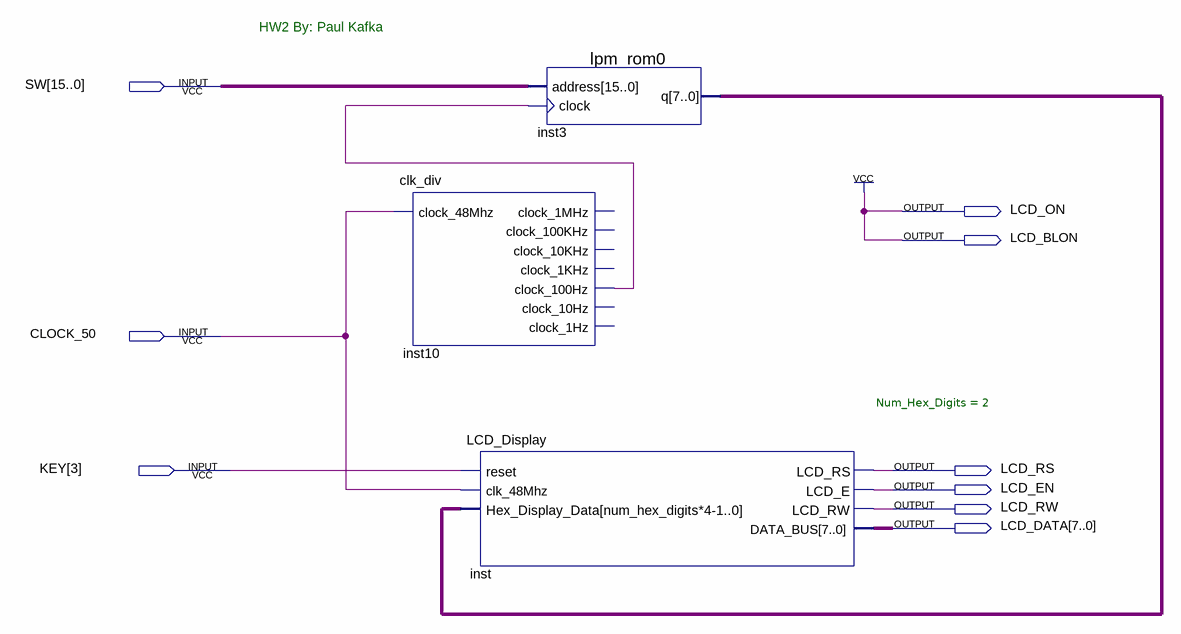
[diagram p0: schematic sheet]
// Quartus schematic tutorial2.bdf as structural Verilog: 3 symbols, 9 pins
module tutorial2 (
  input  [15:0] SW,
  input  CLOCK_50,
  input  [3:3] KEY,
  output LCD_ON,
  output LCD_BLON,
  output LCD_RS,
  output LCD_EN,
  output LCD_RW,
  output [7:0] LCD_DATA
);

  wire inst10_clock_100hz;
  wire [7:0] inst3_q;

  clk_div inst10 (
    .clock_48Mhz(CLOCK_50), .clock_100Hz(inst10_clock_100hz));  // open: clock_1MHz, clock_100KHz, clock_10KHz, clock_1KHz, clock_10Hz, clock_1Hz
  lpm_rom0 inst3 (.address(SW), .clock(inst10_clock_100hz), .q(inst3_q));
  LCD_Display #(.Num_Hex_Digits(2)) inst (
    .reset(KEY[3]), .clk_48Mhz(CLOCK_50), .Hex_Display_Data(inst3_q), .LCD_RS(LCD_RS), .LCD_E(LCD_EN),
    .LCD_RW(LCD_RW), .DATA_BUS(LCD_DATA));

  assign LCD_BLON = 1'b1;
  assign LCD_ON = 1'b1;

  // Notes on the sheet:
  //   HW2 By: Paul Kafka
endmodule
